# EAGLE board 2i (EAGLE 6.4), part 1 of 2
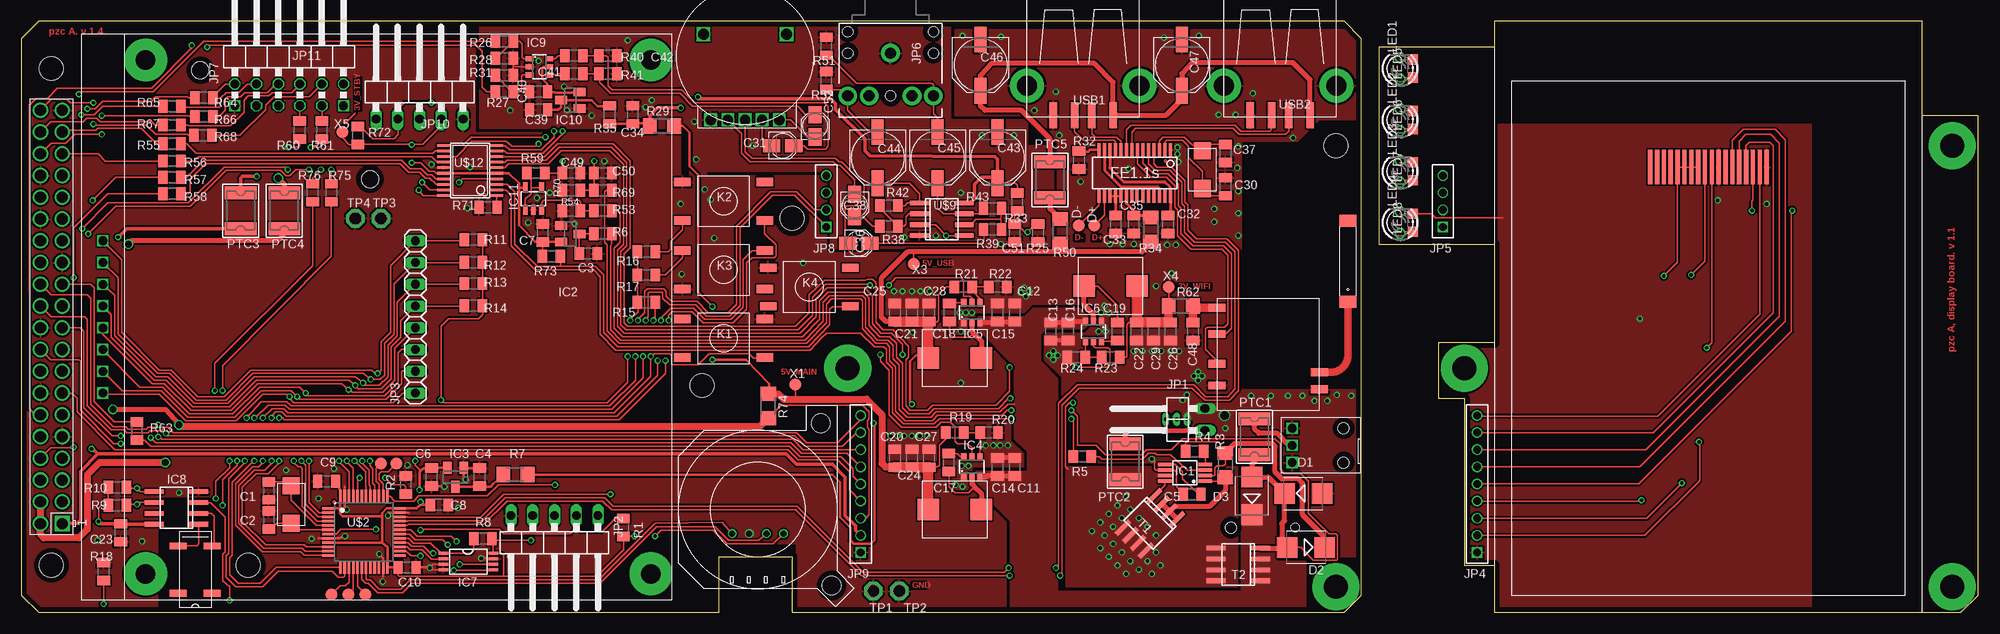
[diagram p1: board, top side]
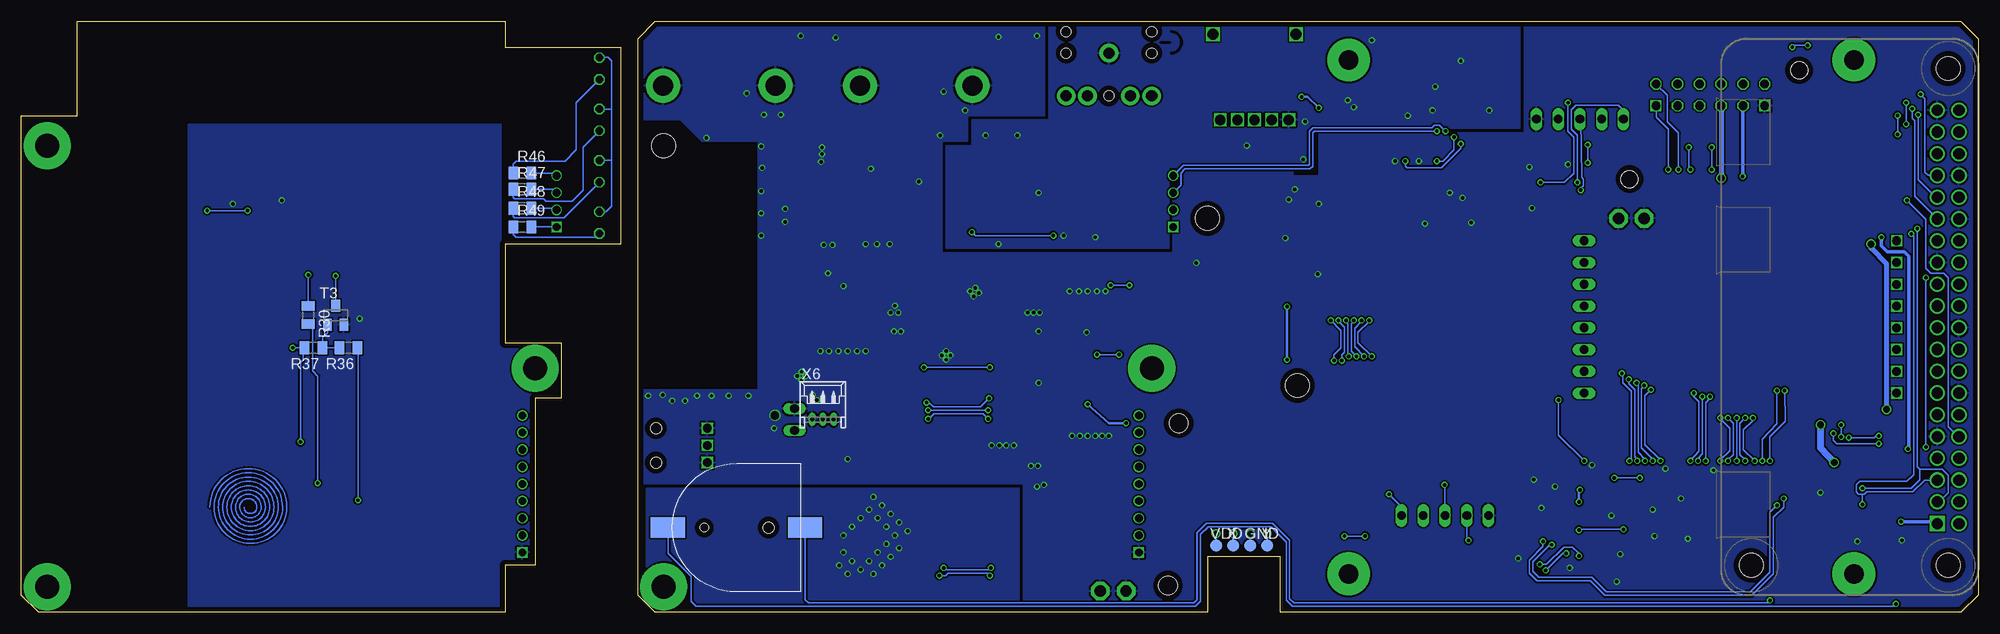
[diagram p2: board, bottom side, seen from below]

Size 228.5 x 69 mm. Coordinates in mm from the lower left corner, seen from the top.
Outline: 0,2 2,0 81.5,0 81.5,6.5 90,6.5 90,0 154.5,0 156.5,2 156.5,67 154.5,69 2,69 0,67 0,2
Outline: 168.5,5.5 172,5.5 172,0 226.5,0 228.5,2 228.5,58 222,58 222,69 172,69 172,66 158.5,66 158.5,43 172,43 172,31.5 165.5,31.5 165.5,25 168.5,25 168.5,5.5
Copper layers (1*16): Top 0.035mm / dielectric 1.5mm / Bottom 0.035mm
Design rules "ch_6": minimum track width 0.15mm, minimum drill 0.4mm, track to track 0.2mm, track to pad 0.2mm, pad to pad 0.2mm, via to via 0.2mm, smd to smd 0.2mm, copper to edge 0.6mm, drill to drill 8mil, minimum pad ring 0.15mm, minimum via ring 0.15mm, stop-mask expansion 4mil, vias tented up to drill 0mil, thermal gap 10mil
Holes 2.8 mm at 79.5,26.5 90,46 153.5,54.5
Holes 2 mm at 40.7,50.6 20.9,63.3
bRestrict: 2 lines

## Footprints (pad centres in the part's own frame; a part is rotated, then mirrored left to right if it is on the bottom)
ANT_RAINSUN-24G = smd 2 x 1.4: 1 0,-4.75; 2 0,4.75
R0805 = smd 1.1 x 1.5: 1 -1.05,0; 2 1.05,0
PANASONIC_A = smd 2 x 1.5: + 1.3,0; - -1.3,0
PANASONIC_D = smd 3 x 1.4: + 3,0; - -3,0
SMB = smd 2.4 x 2.4: A 2.2,0; C -2.2,0
TP14R = smd 1.4 x 1.4: TP 0,0
MSOP8 = smd 0.4 x 1.6: 1 -0.975,-2.35; 2 -0.325,-2.35; 3 0.325,-2.35; 4 0.975,-2.35; 5 0.975,2.35; 6 0.325,2.35; 7 -0.325,2.35; 8 -0.975,2.35
SOT23 = smd 1 x 1.4: 1 -0.95,-1.1; 2 0.95,-1.1; 3 0,1.1
SOT23-6 = smd 0.6 x 0.9: 1 -0.95,-1.15; 2 0,-1.15; 3 0.95,-1.15; 4 0.95,1.15; 5 0,1.15; 6 -0.95,1.15
TSSOP8W = smd 1.1 x 0.35: 1 -3.045,1.205; 2 -3.045,0.555; 3 -3.045,-0.095; 4 -3.045,-0.745; 5 2.805,-0.745; 6 2.805,-0.095; 7 2.805,0.555; 8 2.805,1.205
SO-08 = smd 0.55 x 2.2: 1 -1.905,-2.6; 2 -0.635,-2.6; 3 0.635,-2.6; 4 1.905,-2.6; 5 1.905,2.6; 6 0.635,2.6; 7 -0.635,2.6; 8 -1.905,2.6
SOT23-5L = smd 0.55 x 1.2: 1 -0.95,-1.3; 2 0,-1.3; 3 0.95,-1.3; 4 0.95,1.3; 5 -0.95,1.3
1X02/90 = drill 1 long: 1 -2.54,-3.81; 2 0,-3.81
1X05/90 = drill 1.016 long: 1 -5.08,-3.81; 2 -2.54,-3.81; 3 0,-3.81; 4 2.54,-3.81; 5 5.08,-3.81
1X08 = drill 1.016 long: 1 -8.89,0; 2 -6.35,0; 3 -3.81,0; 4 -1.27,0; 5 1.27,0; 6 3.81,0; 7 6.35,0; 8 8.89,0
1X09M = drill 0.914 square: 1 -8,0 | drill 0.914: 2 -6,0; 3 -4,0; 4 -2,0; 5 0,0; 6 2,0; 7 4,0; 8 6,0; 9 8,0
1X04M = drill 0.914 square: 1 -3,0 | drill 0.914: 2 -1,0; 3 1,0; 4 3,0
AUDIO-JACK = drill 1.3 pad 2.184: RING 5,5; RSH 5,2.5; SLEEVE 0,0; TIP 5,-5; TSH 5,-2.5 | hole 1.2: 0,5; -2.5,5; -2.5,-5; 0,-5; 5,0
2X05/90 = drill 1.016 square: 1 -5.08,-6.35 | drill 1.016 octagon: 2 -5.08,-3.81; 3 -2.54,-6.35; 4 -2.54,-3.81; 5 0,-6.35; 6 0,-3.81; 7 2.54,-6.35; 8 2.54,-3.81; 9 5.08,-6.35; 10 5.08,-3.81
2X01/90 = drill 1.016 square: 1 -1.27,-6.35 | drill 1.016 octagon: 2 -1.27,-3.81
SW_SMD2 = smd 1.93 x 0.965: 1A -4.8,2.25; 1B -4.8,-2.25; 2A 4.8,2.25; 2B 4.8,-2.25
LED3MM = drill 0.9 octagon: A -1.27,0; K 1.27,0
CHIPLED_0805 = smd 1.2 x 1.2: A 0,-1.05; C 0,1.05
MOD_USB_RTL8188 = smd 2 x 0.9: 3V3 12,-11.98; ANT 0,-4.45; D+ 12,-5.425; D- 12,-8.9; GND 12,-2.903; RFGND 0,-2.45
PTC1812 = smd 1.5 x 3.7: P$1 -2.1,0; P$2 2.1,0
CRYST_32K_87X38MM = smd 0.8 x 2: 1 -2.75,-2; 2 2.75,-2; 3 2.75,2; 4 -2.75,2
R1206 = smd 1.6 x 1.803: 1 -1.422,0; 2 1.422,0
DISP_ILI_28 = smd 0.5 x 4: 1 -6.8,17; 2 -6,17; 3 -5.2,17; 4 -4.4,17; 5 -3.6,17; 6 -2.8,17; 7 -2,17; 8 -1.2,17; 9 -0.4,17; 10 0.4,17; 11 1.2,17; 12 2,17; 13 2.8,17; 14 3.6,17; 15 4.4,17; 16 5.2,17; 17 6,17; 18 6.8,17
P1-13 = drill 1.321 pad 2.159 octagon: TP 0,0
CON_DC13 = drill 1 square: 1 8,3.2; 2 8,1.2; 3 8,5.2 | hole 1.3: 2,5.2; 2,1.2
LQFP48 = smd 1.5 x 0.3: 1 -4.15,2.75; 2 -4.15,2.25; 3 -4.15,1.75; 4 -4.15,1.25; 5 -4.15,0.75; 6 -4.15,0.25; 7 -4.15,-0.25; 8 -4.15,-0.75; 9 -4.15,-1.25; 10 -4.15,-1.75; 11 -4.15,-2.25; 12 -4.15,-2.75; 25 4.15,-2.75; 26 4.15,-2.25; 27 4.15,-1.75; 28 4.15,-1.25; 29 4.15,-0.75; 30 4.15,-0.25; 31 4.15,0.25; 32 4.15,0.75; 33 4.15,1.25; 34 4.15,1.75; 35 4.15,2.25; 36 4.15,2.75 | smd 0.3 x 1.5: 13 -2.75,-4.15; 14 -2.25,-4.15; 15 -1.75,-4.15; 16 -1.25,-4.15; 17 -0.75,-4.15; 18 -0.25,-4.15; 19 0.25,-4.15; 20 0.75,-4.15; 21 1.25,-4.15; 22 1.75,-4.15; 23 2.25,-4.15; 24 2.75,-4.15; 37 2.75,4.15; 38 2.25,4.15; 39 1.75,4.15; 40 1.25,4.15; 41 0.75,4.15; 42 0.25,4.15; 43 -0.25,4.15; 44 -0.75,4.15; 45 -1.25,4.15; 46 -1.75,4.15; 47 -2.25,4.15; 48 -2.75,4.15
BOURNS_SRP7030 = smd 2.5 x 2.5: P$1 3.1,0; P$2 -3.1,0
BATT_HOLDER_DS1092-12 = smd 4 x 2.4: N -8,0; POS 8,0 | hole 1: -3.75,0 | hole 1.3: 3.75,0
KB1604 = drill 1 square: 1 -8.89,-2.5; 2 -6.35,-2.5; 3 -3.81,-2.5; 4 -1.27,-2.5; 5 1.27,-2.5; 6 3.81,-2.5; 7 6.35,-2.5; 8 8.89,-2.5 | drill 2.3 pad 5: P$2 -30,2.5; P$3 30,2.5; P$4 -30,61.5; P$5 30,61.5
JOY_PS = hole 2.2: 10.09,-7.35; -8.85,-8.61
POT_14X2DUAL = drill 1.2 square: G -4,-7.5; T1 4,-7.5; T2 2,-7.5; W1 -2,-7.5; W2 0,-7.5 | drill 1.3 square: P$1 -4.85,2.5; P$2 4.85,2.5
RPI_ZERO_NBRH = drill 1.3 pad 1.778 square: 1 8.37,25.23 | drill 1.3 pad 1.778: 2 8.37,27.77; 3 10.91,25.23; 4 10.91,27.77; 5 13.45,25.23; 6 13.45,27.77; 7 15.99,25.23; 8 15.99,27.77; 9 18.53,25.23; 10 18.53,27.77; 11 21.07,25.23; 12 21.07,27.77; 13 23.61,25.23; 14 23.61,27.77; 15 26.15,25.23; 16 26.15,27.77; 17 28.69,25.23; 18 28.69,27.77; 19 31.23,25.23; 20 31.23,27.77; 21 33.77,25.23; 22 33.77,27.77; 23 36.31,25.23; 24 36.31,27.77; 25 38.85,25.23; 26 38.85,27.77; 27 41.39,25.23; 28 41.39,27.77; 29 43.93,25.23; 30 43.93,27.77; 31 46.47,25.23; 32 46.47,27.77; 33 49.01,25.23; 34 49.01,27.77; 35 51.55,25.23; 36 51.55,27.77; 37 54.09,25.23; 38 54.09,27.77; 39 56.63,25.23; 40 56.63,27.77 | hole 2.8: 3.5,3.5; 3.5,26.5; 61.5,26.5
TSSOP20 = smd 0.3 x 1.5: 1 -2.925,-3.118; 2 -2.275,-3.118; 3 -1.625,-3.118; 4 -0.975,-3.118; 5 -0.325,-3.118; 6 0.325,-3.118; 7 0.975,-3.118; 8 1.625,-3.118; 9 2.275,-3.118; 10 2.925,-3.118; 11 2.925,3.118; 12 2.275,3.118; 13 1.625,3.118; 14 0.975,3.118; 15 0.325,3.118; 16 -0.325,3.118; 17 -0.975,3.118; 18 -1.625,3.118; 19 -2.275,3.118; 20 -2.925,3.118
FE1.1S_SSOP-28 = smd 0.35 x 1.5: 1 -4.16,-2.7; 2 -3.52,-2.7; 3 -2.88,-2.7; 4 -2.24,-2.7; 5 -1.6,-2.7; 6 -0.96,-2.7; 7 -0.32,-2.7; 8 0.32,-2.7; 9 0.96,-2.7; 10 1.6,-2.7; 11 2.24,-2.7; 12 2.88,-2.7; 13 3.52,-2.7; 14 4.16,-2.7; 15 4.16,2.7; 16 3.52,2.7; 17 2.88,2.7; 18 2.24,2.7; 19 1.6,2.7; 20 0.96,2.7; 21 0.32,2.7; 22 -0.3,2.7; 23 -0.96,2.7; 24 -1.6,2.7; 25 -2.24,2.7; 26 -2.88,2.7; 27 -3.52,2.7; 28 -4.16,2.7
USB-A-S = smd 3 x 0.9: D+ 3.45,-1; D- 3.45,1; GND 3.45,-3.5; VBUS 3.45,3.5 | drill 2.3 pad 4: GND@1 0,6.566; GND@2 0,-6.566
CR_12SMXA_S = smd 2 x 2: P$1 -2.2,0; P$2 2.2,0
53048-03 = drill 0.5 pad 0.698 long: 1 1.25,-1.25; 2 0,-1.25; 3 -1.25,-1.25

## Placement (x,y rotation side)
ANT1  ANT_RAINSUN_24GHZ  [ANT_RAINSUN-24G]  154.9,41 0 top
C1  33  [R0805]  28.9,14.2 90 top
C2  33  [R0805]  28.9,10.8 270 top
C3  1u  [R0805]  66.2,41.9 0 top
C4  1u  [R0805]  53.5,15.8 90 top
C5  100n  [R0805]  136.7,13.8 180 top
C6  1u  [R0805]  47.9,15.8 270 top
C7  1u  [R0805]  60.9,44.3 90 top
C8  100n  [R0805]  48.8,12.55 0 top
C9  100n  [R0805]  35.65,15.3 180 top
C10  100n  [R0805]  45.05,5.25 0 top
C11  22u  [R0805]  116,17 90 top
C12  22u  [R0805]  116,35 90 top
C13  22u  [R0805]  120.2,32.8 270 top
C14  22u  [R0805]  114,17 90 top
C15  22u  [R0805]  114,35 90 top
C16  22u  [R0805]  122.2,32.8 270 top
C17  100n  [R0805]  108.3,17.5 270 top
C18  100n  [R0805]  108.4,35 270 top
C19  100n  [R0805]  128,32.8 90 top
C20  22u  [R0805]  102,18 90 top
C21  22u  [R0805]  104,35 90 top
C22  22u  [R0805]  130.2,32.8 270 top
C23  100n  [R0805]  11.6,9.3 270 top
C24  22u  [R0805]  104,18 90 top
C25  22u  [R0805]  102,35 90 top
C26  22u  [R0805]  134.2,32.8 270 top
C27  22u  [R0805]  106,18 90 top
C28  22u  [R0805]  106,35 90 top
C29  22u  [R0805]  132.2,32.8 270 top
C30  33  [R0805]  140.6,49.7 270 top
C31  10u  [PANASONIC_A]  88.9,54.5 0 top
C32  10u  [R0805]  133.9,45.3 90 top
C33  10u  [R0805]  127.8,45.3 90 top
C34  10u  [R0805]  71.4,58.1 270 top
C35  10u  [R0805]  129.9,45.3 90 top
C36  10u  [PANASONIC_A]  97.8,43.1 0 top
C37  33  [R0805]  140.6,53.6 90 top
C38  10u  [PANASONIC_A]  97.3,47.5 270 top
C39  10u  [R0805]  60.4,58.7 0 top
C40  10u  [R0805]  60.4,60.8 0 top
C41  470  [R0805]  68.5,62.9 180 top
C42  470  [R0805]  68.5,65 180 top
C43  100u  [PANASONIC_D]  114,53.1 270 top
C44  220u  [PANASONIC_D]  100,53.1 270 top
C45  220u  [PANASONIC_D]  107,53.1 270 top
C46  100u  [PANASONIC_D]  112,63.9 270 top
C47  100u  [PANASONIC_D]  135.5,63.9 270 top
C48  22u  [R0805]  136.8,32.8 90 top
C49  100n  [R0805]  64.2,51.3 180 top
C50  100n  [R0805]  67.9,51.3 180 top
C51  22u  [R0805]  116,44.3 270 top
C52  10u  [PANASONIC_A]  92.7,56.8 90 top
D1  12V  [SMB]  149.7,13.9 0 top
D2  1N5818  [SMB]  150,7.6 180 top
D3  1N5818  [SMB]  143.7,13.6 90 top
D+  TPTP14R  [TP14R]  125.3,45.2 90 top
D-  TPTP14R  [TP14R]  123.5,45.2 90 top
GND  TPTP14R  [TP14R]  85,7.8 0 bottom
IC1  MCP73844  [MSOP8]  135.9,16.3 90 top
IC2  MCP1702-SOT23  [SOT23]  64.1,44.2 270 top
IC3  MCP1702-SOT23  [SOT23]  50.7,15.8 180 top
IC4  TPS562200  [SOT23-6]  111,17 0 top
IC5  TPS562200  [SOT23-6]  111,35 0 top
IC6  TPS562200  [SOT23-6]  125.2,32.8 180 top
IC7  EEPROM_SPI-TSSOP  [TSSOP8W]  52.3,5.7 0 top
IC8  PCF8523  [SO-08]  18.1,12.2 90 top
IC9  74LVC2G34  [SOT23-6]  60.5,63.7 270 top
IC10  MCP1702-SOT23  [SOT23]  64.1,59.8 90 top
IC11  MCP6021  [SOT23-5L]  59.8,48.3 0 top
JP1  [1X02/90]  134.4,23.8 90 top
JP2  [1X05/90]  62.25,7.5 180 top
JP3  [1X08]  46,34.5 90 top
JP4  [1X09M]  170,15 90 top
JP5  [1X04M]  166,48 90 top
JP6  [AUDIO-JACK]  101.5,65.3 270 top
JP7  [2X05/90]  30,65.5 0 top
JP8  [1X04M]  94,48 90 top
JP9  [1X09M]  98,15 90 top
JP10  [1X05/90]  46.5,61.4 0 top
JP11  PINHD-2X01_2.54-90°  [2X01/90]  38.89,65.5 0 top
K1  SWITCH_BD_B  [SW_SMD2]  82,32 180 top
K2  SWITCH_BD_B  [SW_SMD2]  82,48 180 top
K3  SWITCH_BD_B  [SW_SMD2]  82,40 180 top
K4  SWITCH_BD_B  [SW_SMD2]  92,38 180 top
LED1  [LED3MM]  161,63.5 90 top
LED2  [LED3MM]  161,57.5 90 top
LED3  [LED3MM]  161,51.5 90 top
LED4  [LED3MM]  161,45.5 90 top
LED5  [CHIPLED_0805]  162.5,63.5 0 top
LED6  [CHIPLED_0805]  162.5,57.5 0 top
LED7  [CHIPLED_0805]  162.5,51.5 0 top
LED8  [CHIPLED_0805]  162.5,45.5 0 top
MOD1  MOD_USB_RTL8188  [MOD_USB_RTL8188]  151.6,23.6 180 top
PTC1  1,1A  [PTC1812]  144,20.5 90 top
PTC2  1,1A  [PTC1812]  128.9,17.6 270 top
PTC3  1,1A  [PTC1812]  25.6,46.9 270 top
PTC4  1,1A  [PTC1812]  30.7,46.9 90 top
PTC5  1,1A  [PTC1812]  120.1,50.5 270 top
Q1  CRYSTAL87X38  [CRYST_32K_87X38MM]  20.3,5 270 top
R1  10k  [R0805]  70.3,9.9 270 top
R2  10k  [R0805]  44.9,14.9 90 top
R3  0R47  [R1206]  140.6,17.2 270 top
R4  10k  [R0805]  137,18.8 0 top
R5  2k7  [R0805]  123.9,18.2 180 top
R6  47R  [R0805]  67.9,44.2 0 top
R7  0R1  [R1206]  57.7,16.1 180 top
R8  10k  [R0805]  53.9,8.6 180 top
R9  10k  [R0805]  11.2,12.5 180 top
R10  10k  [R0805]  11.2,14.6 180 top
R11  10k  [R0805]  52.8,43.5 0 top
R12  10k  [R0805]  52.8,40.9 0 top
R13  10k  [R0805]  52.8,38.4 0 top
R14  10k  [R0805]  52.8,35.8 0 top
R15  10k  [R0805]  73,36.2 0 top
R16  10k  [R0805]  73,42.1 0 top
R17  10k  [R0805]  73,39.4 0 top
R18  0R  [R0805]  9.6,4.8 270 top
R19  56k  [R0805]  109,21 0 top
R20  10k  [R0805]  113,21 180 top
R21  56k  [R0805]  110,38 0 top
R22  10k  [R0805]  114,38 180 top
R23  33k  [R0805]  127.2,29.8 180 top
R24  10k  [R0805]  123.2,29.8 0 top
R25  10k  [R0805]  118.7,44.3 90 top
R26  470  [R0805]  56.4,66.7 180 top
R27  470  [R0805]  56.4,60.8 180 top
R28  10k  [R0805]  56.4,64.7 180 top
R29  0R1  [R1206]  74.8,56.8 0 top
R30  47  [R0805]  195,34.7 270 bottom
R31  10k  [R0805]  56.4,62.7 180 top
R32  2k7  [R0805]  123.5,52.8 90 top
R33  10k  [R0805]  116.3,47.9 90 top
R34  0R1  [R1206]  131.9,44.7 270 top
R35  47R  [R0805]  68.7,58.1 90 top
R36  470  [R0805]  190.3,30.9 180 bottom
R37  10k  [R0805]  194.4,30.9 180 bottom
R38  10k  [R0805]  101.3,45.1 0 top
R39  10k  [R0805]  113.4,44.7 0 top
R40  22k  [R0805]  64.5,65 180 top
R41  22k  [R0805]  64.5,62.9 180 top
R42  10k  [R0805]  101.3,47.5 0 top
R43  10k  [R0805]  113.4,47.2 180 top
R46  470  [R0805]  170,51.3 0 bottom
R47  470  [R0805]  170,49.4 0 bottom
R48  470  [R0805]  170,47.2 0 bottom
R49  470  [R0805]  170,45 0 bottom
R50  0R1  [R1206]  121.3,44.5 270 top
R51  470  [R0805]  94,66.1 90 top
R52  470  [R0805]  94,62.1 90 top
R53  10M  [R0805]  67.9,46.9 0 top
R54  3M3  [R0805]  64.2,46.9 0 top
R55  470  [R0805]  17.6,54.7 0 top
R56  470  [R0805]  17.6,52.7 0 top
R57  470  [R0805]  17.6,50.8 0 top
R58  470  [R0805]  17.6,48.9 0 top
R59  47R  [R0805]  60.1,51.3 180 top
R60  470  [R0805]  32.5,56.3 90 top
R61  470  [R0805]  35.1,56.3 90 top
R62  0R1  [R1206]  135.4,35.8 0 top
R63  47  [R0805]  13.5,21.2 90 top
R64  470  [R0805]  21.3,60.1 180 top
R65  470  [R0805]  17.6,59.1 180 top
R66  470  [R0805]  21.3,57.9 180 top
R67  470  [R0805]  17.6,56.9 180 top
R68  470  [R0805]  21.2,55.7 180 top
R69  56k  [R0805]  67.9,49.3 0 top
R70  10k  [R0805]  64.2,49.3 0 top
R71  10k  [R0805]  54.5,47.3 180 top
R72  10k  [R0805]  39.3,55.7 270 top
R73  10k  [R0805]  61.9,41.6 180 top
R74  0R1  [R1206]  87.2,24.1 270 top
R75  470  [R0805]  36.2,49 90 top
R76  470  [R0805]  34,49 90 top
T1  PFET_SO8  [SO-08]  131.8,10.4 135 top
T2  PFET_SO8  [SO-08]  142.1,5.6 90 top
T3  BC847  [SOT23]  191.8,34.7 0 bottom
TFT1  DISP_ILI_28  [DISP_ILI_28]  197,69 180 top
TP1  PTR1PAD1-13  [P1-13]  99.5,2.5 0 top
TP2  PTR1PAD1-13  [P1-13]  102.5,2.5 0 top
TP3  PTR1PAD1-13  [P1-13]  42,46 0 top
TP4  PTR1PAD1-13  [P1-13]  39,46 0 top
U$1  CONN_DC_13  [CON_DC13]  156.4,22.7 180 top
U$2  STM32F072-LQFP48  [LQFP48]  40,9.4 0 top
U$3  2u2  [BOURNS_SRP7030]  109,12 0 top
U$4  2u2  [BOURNS_SRP7030]  109,29.7 0 top
U$5  2u2  [BOURNS_SRP7030]  127.2,38.1 180 top
U$6  BATTH1220  [BATT_HOLDER_DS1092-12]  145,9.9 0 bottom
U$7  KB1604  [KB1604]  12,34.5 270 top
U$8  JOY_PS  [JOY_PS]  86,12 90 top
U$9  TDA1308  [SO-08]  107.5,45.9 270 top
U$10  POT_DUAL_14X2  [POT_14X2DUAL]  84.5,65 0 top
U$11  RPI-ZERONBRH  [RPI_ZERO_NBRH]  30,2 90 top
U$12  STM32F030_20  [TSSOP20]  52.4,51.6 90 top
USB  FE1.1S  [FE1.1S_SSOP-28]  130,51.3 180 top
USB1  USB-A-S  [USB-A-S]  124,61.5 270 top
USB2  USB-A-S  [USB-A-S]  147,61.5 270 top
VDD  TPTP14R  [TP14R]  89,7.8 0 bottom
X  TPTP14R  [TP14R]  87,7.8 0 bottom
X1  TPTP14R  [TP14R]  90.4,26.6 0 top
X2  CRYST_TC26SMXAS  [CR_12SMXA_S]  31.5,12.6 270 top
X3  TPTP14R  [TP14R]  104.2,40.7 0 top
X4  TPTP14R  [TP14R]  134,38 0 top
X5  TPTP14R  [TP14R]  37.5,56.1 0 top
X6  53048-03  [53048-03]  134.9,23.8 0 bottom
X7  TPTP14R  [TP14R]  36.2,2.1 90 top
X8  TPTP14R  [TP14R]  38.2,2.1 90 top
X9  TPTP14R  [TP14R]  40.2,2.1 90 top
X12  TPTP14R  [TP14R]  43.8,17.4 0 top
X13  TPTP14R  [TP14R]  42,17.4 0 top
X14  CRYST_TC26SMXAS  [CR_12SMXA_S]  137.9,51.7 90 top
Y  TPTP14R  [TP14R]  83,7.8 0 bottom